# Altium project SAU-G0-EVM.PrjPcb
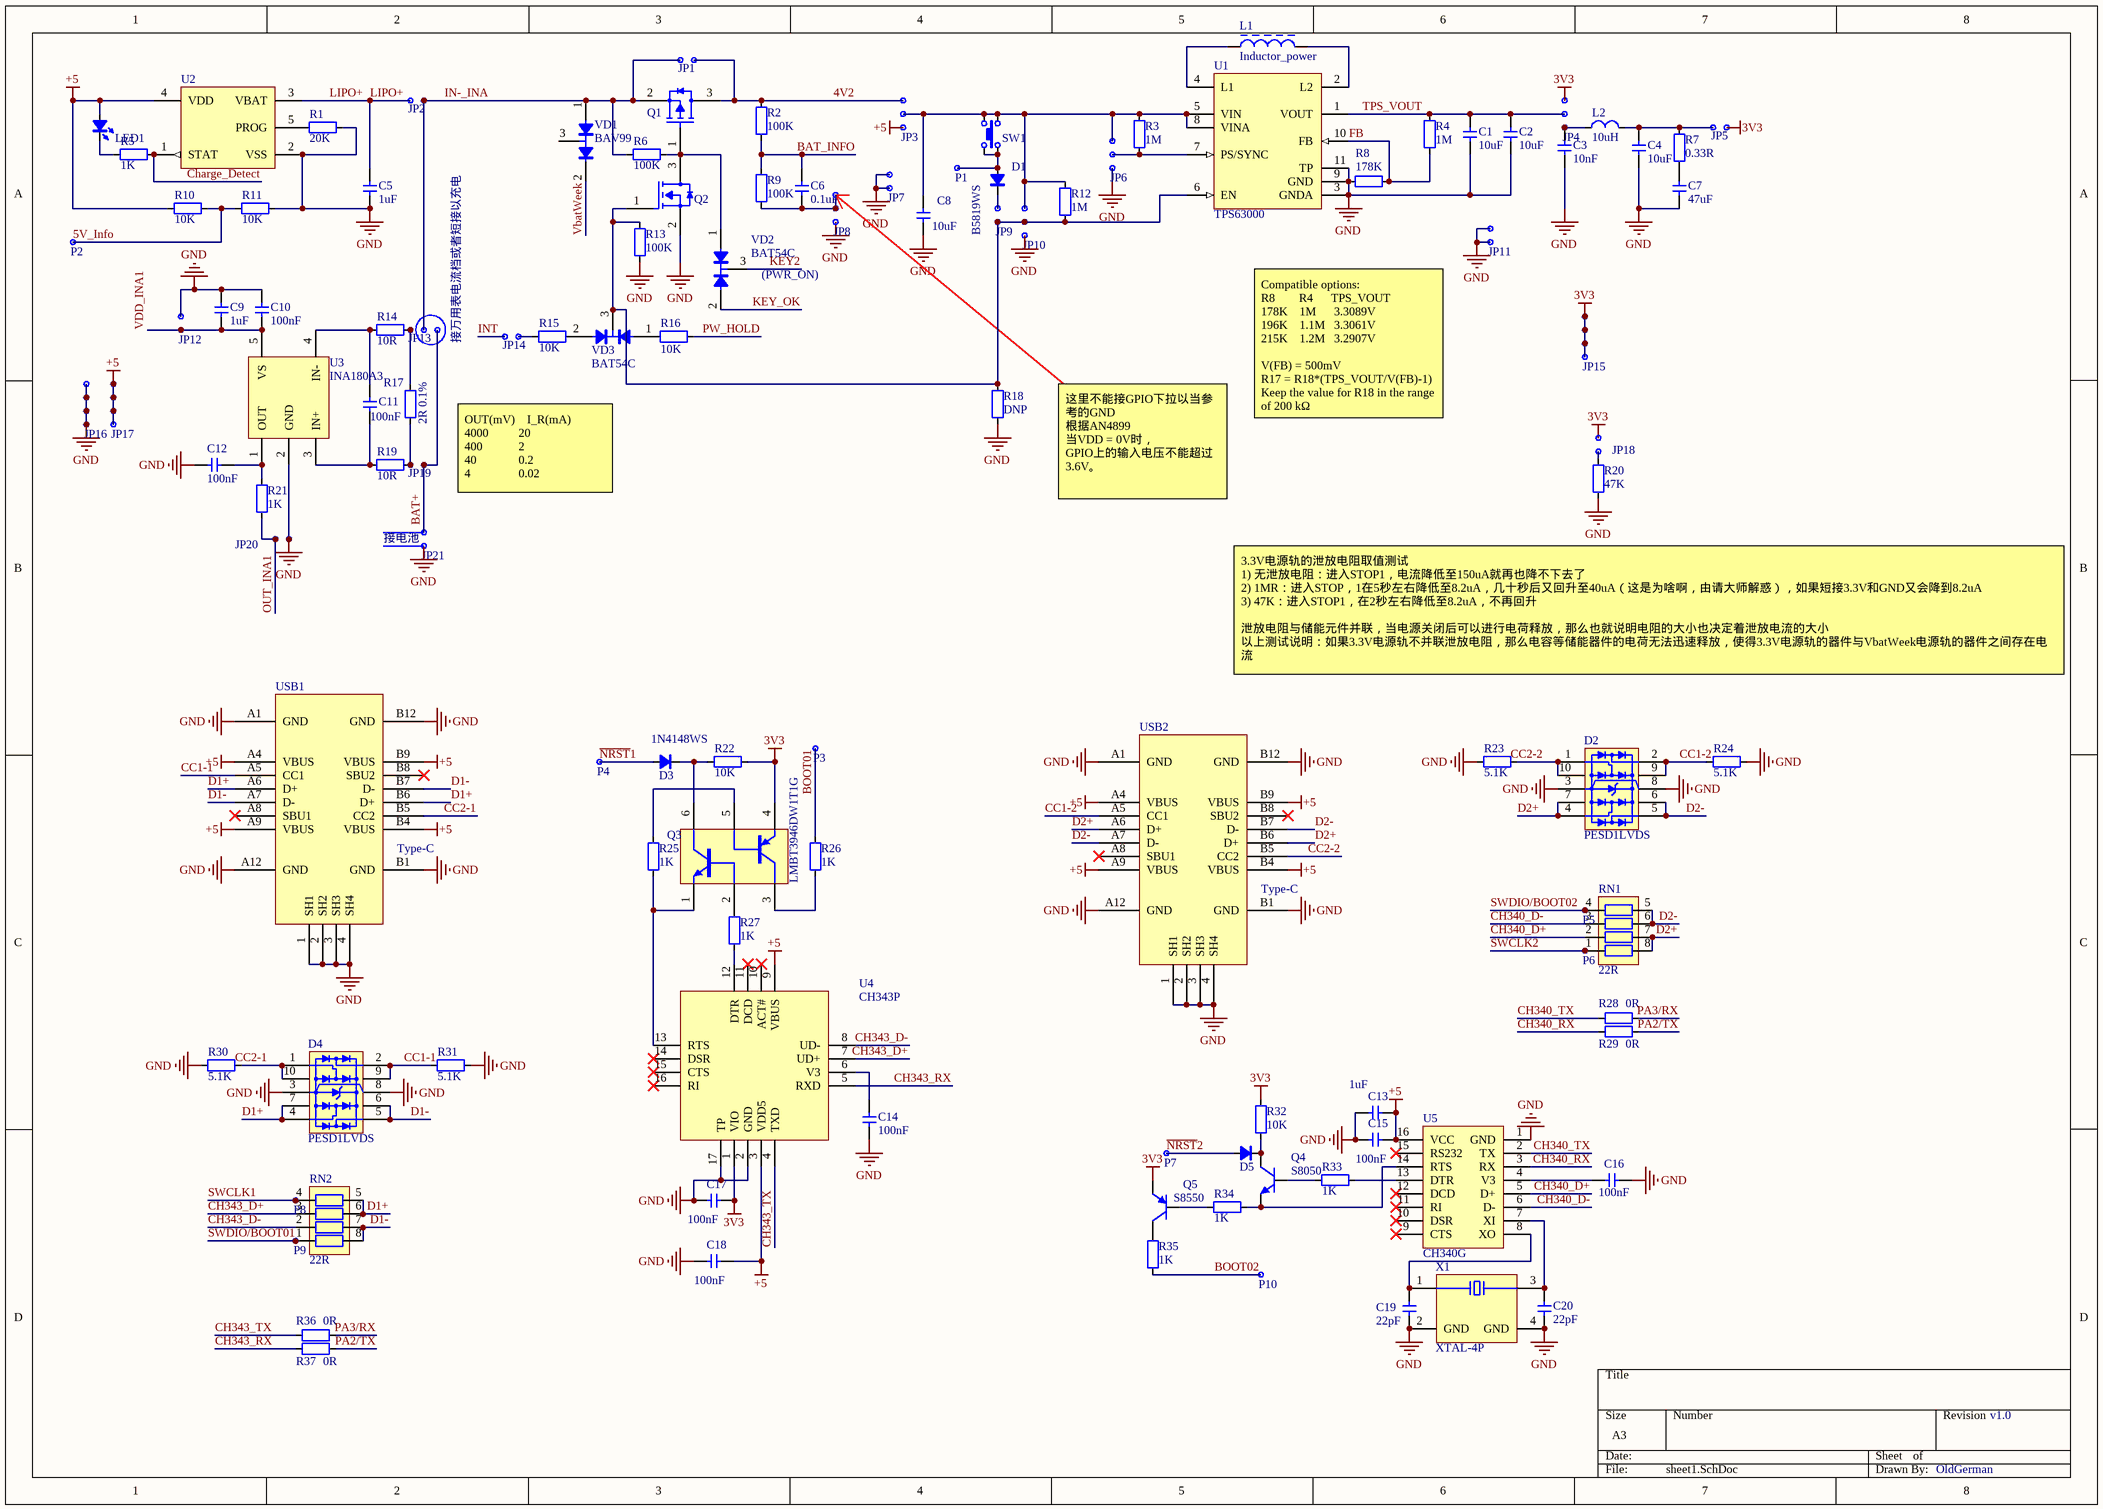
[diagram p0: sheet1.SchDoc]
4 sheets, 275 parts. Net scope: global (net labels, ports and power ports of the same name join across sheets).
Board file: pcb.PcbDoc
Sheets:
  sheet1.SchDoc
  sheet2.SchDoc
  sheet3.SchDoc
  sheet4.SchDoc

## Sheet sheet1.SchDoc
size A3

### Parts
C1  10uF  [C0603]
C2  10uF  [C0603]
C3  10nF  [C0603]
C4  10uF  [C0603]
C5  1uF  [C0603]
C6  0.1uF  [C0603]
C7  47uF  [C1206]
C8  10uF  [C0603]
C9  1uF  [C0603]
C10  100nF  [C0603]
C11  100nF  [C0603]
C12  100nF  [C0603]
C13  1uF  [C0603]
C14  100nF  [C0603]
C15  100nF  [C0603]
C16  100nF  [C0603]
C17  100nF  [C0603]
C18  100nF  [C0603]
C19  22pF  [C0603]
C20  22pF  [C0603]
D1  B5819WS  [SOD-323]
D2  PESD1LVDS  [DFN2510-10_SOT1165-1]
D3  1N4148WS  [SOD-323]
D4  PESD1LVDS  [DFN2510-10_SOT1165-1]
D5  DIODE  [SOD-323]  (value not drawn)
JP1  CONN_X2_DOT  [2.54mm_Male_x2]  (value not drawn)
JP2  CONN_X2_DOT  [2.54mm_Male_x2]  (value not drawn)
JP3  CONN_X3_DOT  [2.54mm_Male_x3]  (value not drawn)
JP4  CONN_X3_DOT  [2.54mm_Male_x3]  (value not drawn)
JP5  CONN_X2_DOT  [2.54mm_Male_x2]  (value not drawn)
JP6  CONN_X3_DOT  [2.54mm_Male_x3]  (value not drawn)
JP7  CONN_X2_DOT  [2.54mm_Male_x2]  (value not drawn)
JP8  CONN_X3_DOT  [2.54mm_Male_x3]  (value not drawn)
JP9  CONN_X2_DOT  [2.54mm_Male_x2]  (value not drawn)
JP10  CONN_X3_DOT  [2.54mm_Male_x3]  (value not drawn)
JP11  CONN_X2_DOT  [2.54mm_Male_x2]  (value not drawn)
JP12  CONN_X2_DOT  [2.54mm_Male_x2]  (value not drawn)
JP13  CONN_X3_DOT  [2.54mm_Male_x3]  (value not drawn)
JP14  CONN_X2_DOT  [2.54mm_Male_x2]  (value not drawn)
JP15  CONN_X4_DOT  [2.54mm_Male_x4]  (value not drawn)
JP16  CONN_X4_DOT  [2.54mm_Male_x4]  (value not drawn)
JP17  CONN_X4_DOT  [2.54mm_Male_x4]  (value not drawn)
JP18  CONN_X2_DOT  [2.54mm_Male_x2]  (value not drawn)
JP19  CONN_X2_DOT  [2.54mm_Male_x2]  (value not drawn)
JP20  CONN_X2_DOT  [2.54mm_Male_x2]  (value not drawn)
JP21  CONN_X2_DOT  [2.54mm_Male_x2]  (value not drawn)
L1  Inductor_power  [TDK VLS252012CX]
L2  10uH  [FER0805]
LED1  LED  [LED0603_WHITE]  (value not drawn)
P1  CONN_X1_DOT  [2.54mm_Male_x1]  (value not drawn)
P2  CONN_X1_DOT  [2.54mm_Male_x1]  (value not drawn)
P3  CONN_X1_DOT  [2.54mm_Male_x1]  (value not drawn)
P4  CONN_X1_DOT  [2.54mm_Male_x1]  (value not drawn)
P5  CONN_X1_DOT  [2.54mm_Male_x1]  (value not drawn)
P6  CONN_X1_DOT  [2.54mm_Male_x1]  (value not drawn)
P7  CONN_X1_DOT  [2.54mm_Male_x1]  (value not drawn)
P8  CONN_X1_DOT  [2.54mm_Male_x1]  (value not drawn)
P9  CONN_X1_DOT  [2.54mm_Male_x1]  (value not drawn)
P10  CONN_X1_DOT  [2.54mm_Male_x1]  (value not drawn)
Q1  P-MOS  [INFINEON SOT-23-3]  (value not drawn)
Q2  N-MOS  [INFINEON SOT-23-3]  (value not drawn)
Q3  LMBT3946DW1T1G  [ON SEMI SOT-363]
Q4  S8050  [INFINEON SOT-23-3]
Q5  S8550  [INFINEON SOT-23-3]
R1  20K  [R0603]
R2  100K  [R0603]
R3  1M  [R0603]
R4  1M  [R0603]
R5  1K  [R0603]
R6  100K  [R0603]
R7  0.33R  [R0603]
R8  178K  [R0603]
R9  100K  [R0603]
R10  10K  [R0603]
R11  10K  [R0603]
R12  1M  [R0603]
R13  100K  [R0603]
R14  10R  [R0603]
R15  10K  [R0603]
R16  10K  [R0603]
R17  2R 0.1%  [R0805]
R18  DNP  [R0603]
R19  10R  [R0603]
R20  47K  [R0603]
R21  1K  [R0603]
R22  10K  [R0603]
R23  5.1K  [R0603]
R24  5.1K  [R0603]
R25  1K  [R0603]
R26  1K  [R0603]
R27  1K  [R0603]
R28  0R  [R0603]
R29  0R  [R0603]
R30  5.1K  [R0603]
R31  5.1K  [R0603]
R32  10K  [R0603]
R33  1K  [R0603]
R34  1K  [R0603]
R35  1K  [R0603]
R36  0R  [R0603]
R37  0R  [R0603]
RN1  22R  [RESNET 1206-8 CONCAVE]
RN2  22R  [RESNET 1206-8 CONCAVE]
SW1  Button-4P  [SWITCH_3X4X2.5_4PIN_SMD]  (value not drawn)
U1  TPS63000  [TI PVSON-10 3x3MM DRC]
U2  MCP73831T  [MICROCHIP SOT-23-5 OT]  (value not drawn)
U3  INA180A3  [TI SOT-23-5 DBV]
U4  CH343P  [Analog QFN-16 3x3MM]
U5  CH340G  [TI SOP-16 D]
USB1  Type-C  [Type-C-TOP]
USB2  Type-C  [Type-C-TOP]
VD1  BAV99  [INFINEON SOT-23-3]
VD2  BAT54C  [INFINEON SOT-23-3]
VD3  BAT54C  [INFINEON SOT-23-3]
X1  XTAL-4P  [EPSON TSX-3225]

### Nets
3V3: C17.2 JP4.1 JP5.2 JP15.1 JP15.2 JP15.3 JP15.4 JP18.1 Q3.4(E) Q5.2(E) R22.1 R32.1 U4.1(VIO)
+5: C13.2 C15.2 C18.2 JP3.3 JP17.1 JP17.2 JP17.3 JP17.4 LED1.1(A) R10.2 U2.4(VDD) U4.3(VDD5) U4.9(VBUS) U5.16(VCC) USB1.A4(VBUS) USB1.A9(VBUS) USB1.B4(VBUS) USB1.B9(VBUS) USB2.A4(VBUS) USB2.A9(VBUS) USB2.B4(VBUS) USB2.B9(VBUS)
GND: C1.2 C2.2 C3.1 C4.2 C5.2 C7.2 C8.2 C9.2 C10.2 C12.2 C13.1 C14.2 C15.1 C16.2 C17.1 C18.1 C19.1 C20.1 D2.3(GND) D2.8(GND) D4.3(GND) D4.8(GND) JP6.3 JP7.1 JP7.2 JP8.3 JP10.3 JP11.1 JP11.2 JP12.1 JP16.1 JP16.2 JP16.3 JP16.4 JP20.2 JP21.2 Q2.2(S) R1.1 R8.2 R11.1 R13.1 R18.1 R20.1 R23.2 R24.1 R30.2 R31.1 U1.3(GNDA) U1.9(GND) U1.11(TP) U2.2(VSS) U3.2(GND) U4.2(GND) U4.17(TP) U5.1(GND) USB1.1(SH1) USB1.2(SH2) USB1.3(SH3) USB1.4(SH4) USB1.A1(GND) USB1.A12(GND) USB1.B1(GND) USB1.B12(GND) USB2.1(SH1) USB2.2(SH2) USB2.3(SH3) USB2.4(SH4) USB2.A1(GND) USB2.A12(GND) USB2.B1(GND) USB2.B12(GND) X1.2(GND) X1.4(GND)
4V2: JP1.2 JP3.1 Q1.3(D) R2.2
5V_Info: P2.1 R10.1 R11.2
BAT+: JP13.3 JP19.2 JP21.1
BAT_INFO: C6.1 R2.1 R9.2
BOOT01: P3.1 R26.1
BOOT02: P10.1 R35.2
CC1-1: D4.2(I/O) D4.9(GND) R31.2 USB1.A5(CC1)
CC1-2: D2.2(I/O) D2.9(GND) R24.2 USB2.A5(CC1)
CC2-1: D4.1(I/O) D4.10(GND) R30.1 USB1.B5(CC2)
CC2-2: D2.1(I/O) D2.10(GND) R23.1 USB2.B5(CC2)
CH340_D+: RN1.2 U5.5(D+)
CH340_D-: RN1.3 U5.6(D-)
CH340_RX: R29.1 U5.3(RX)
CH340_TX: R28.1 U5.2(TX)
CH343_D+: RN2.3 U4.7(UD+)
CH343_D-: RN2.2 U4.8(UD-)
CH343_RX: R37.1 U4.5(RXD)
CH343_TX: R36.1 U4.4(TXD)
Charge_Detect: R5.1 U2.1(STAT)
D1+: D4.4(I/O) D4.7(GND) RN2.5 RN2.6 USB1.A6(D+) USB1.B6(D+)
D1-: D4.5(I/O) D4.6(GND) RN2.7 RN2.8 USB1.A7(D-) USB1.B7(D-)
D2+: D2.4(I/O) D2.7(GND) RN1.7 RN1.8 USB2.A6(D+) USB2.B6(D+)
D2-: D2.5(I/O) D2.6(GND) RN1.5 RN1.6 USB2.A7(D-) USB2.B7(D-)
FB: R4.1 R8.1 U1.10(FB)
IN-_INA: JP1.1 JP2.2 JP13.2 Q1.2(S) R6.2 VD1.1
INT: JP14.1
KEY2: VD2.3
KEY_OK: VD2.2
LIPO+: C5.1 JP2.1 U2.3(VBAT)
~{NRST}1: D3.1(A) P4.1
~{NRST}2: D5.1(A) P7.1
OUT_INA1: JP20.1 R21.1
PA2/TX: R29.2 R37.2
PA3/RX: R28.2 R36.2
PW_HOLD: R16.1
SWCLK1: P8.1 RN2.4
SWCLK2: P6.1 RN1.1
SWDIO/BOOT01: P9.1 RN2.1
SWDIO/BOOT02: P5.1 RN1.4
TPS_VOUT: C1.1 C2.1 JP4.2 R4.2 U1.1(VOUT)
VbatWeek: VD1.2
VDD_INA1: C9.1 C10.1 JP12.2 U3.5(VS)
NetC3_2: C3.2 JP4.3 L2.1
NetC4_1: C4.1 JP5.1 L2.2 R7.2
NetC6_2: C6.2 JP8.1 JP8.2 R9.1
NetC7_1: C7.1 R7.1
NetC8_1: C8.1 JP3.2 JP6.1 JP10.1 R3.1 R12.1 SW1.3 SW1.4 U1.5(VIN) U1.8(VINA)
NetC11_1: C11.1 R19.1 U3.3(IN+)
NetC11_2: C11.2 R14.1 U3.4(IN-)
NetC12_1: C12.1 R21.2 U3.1(OUT)
NetC14_1: C14.1 U4.6(V3)
NetC16_1: C16.1 U5.4(V3)
NetC19_2: C19.2 U5.8(XO) X1.1
NetC20_2: C20.2 U5.7(XI) X1.3
NetD1_1: D1.1(A) P1.1 SW1.1 SW1.2
NetD1_2: D1.2(C) JP9.1
NetD3_2: D3.2(C) Q3.6(C) R22.2
NetD5_2: D5.2(C) Q4.3(C) R32.2
NetJP6_2: JP6.2 R3.2 U1.7(PS/SYNC)
NetJP9_2: JP9.2 JP10.2 Q2.1(G) R12.2 R13.2 R18.2 U1.6(EN) VD3.3
NetJP13_1: JP13.1 R14.2 R17.1
NetJP14_2: JP14.2 R15.1
NetJP18_2: JP18.2 R20.2
NetJP19_1: JP19.1 R17.2 R19.2
NetL1_1: L1.1 U1.4(L1)
NetL1_2: L1.2 U1.2(L2)
NetLED1_2: LED1.2(K) R5.2
NetQ1_1: Q1.1(G) Q2.3(D) R6.1 VD2.1
NetQ3_1: Q3.1(E) R25.2 U4.13(RTS)
NetQ3_2: Q3.2(B) R27.2
NetQ3_3: Q3.3(C) R26.2
NetQ3_5: Q3.5(B) R25.1
NetQ4_1: Q4.1(B) R33.1
NetQ4_2: Q4.2(E) R34.2 U5.14(RTS)
NetQ5_1: Q5.1(B) R34.1
NetQ5_3: Q5.3(C) R35.1
NetR1_2: R1.2 U2.5(PROG)
NetR15_2: R15.2 VD3.2
NetR16_2: R16.2 VD3.1
NetR27_1: R27.1 U4.12(DTR)
NetR33_2: R33.2 U5.13(DTR)

Not connected (* = marked no-connect by the designer): U4 10(ACT#)* 11(DCD)* 14(DSR)* 15(CTS)* 16(RI)*; U5 9(CTS)* 10(DSR)* 11(RI)* 12(DCD)* 15(RS232)*; USB1 A8(SBU1)* B8(SBU2)*; USB2 A8(SBU1)* B8(SBU2)*; VD1 3

### Notes on the sheet
- (PWR_ON)
- (near JP13) 接万用表电流档或者短接以充电
- Compatible options:
  R8        R4      TPS_VOUT
  178K    1M      3.3089V
  196K    1.1M   3.3061V
  215K    1.2M   3.2907V
  V(FB) = 500mV
  R17 = R18*(TPS_VOUT/V(FB)-1)
  Keep the value for R18 in the range of 200 kΩ
- OUT(mV)    I_R(mA)
  4000          20
  400            2
  40              0.2
  4                0.02
- 这里不能接GPIO下拉以当参考的GND
  根据AN4899
  当VDD = 0V时，
  GPIO上的输入电压不能超过3.6V。
- (near JP21) 接电池
- 3.3V电源轨的泄放电阻取值测试
  1) 无泄放电阻：进入STOP1，电流降低至150uA就再也降不下去了
  2) 1MR：进入STOP，1在5秒左右降低至8.2uA，几十秒后又回升至40uA（这是为啥啊，由请大师解惑），如果短接3.3V和GND又会降到8.2uA
  3) 47K：进入STOP1，在2秒左右降低至8.2uA，不再回升
  泄放电阻与储能元件并联，当电源关闭后可以进行电荷释放，那么也就说明电阻的大小也决定着泄放电流的大小
  以上测试说明：如果3.3V电源轨不并联泄放电阻，那么电容等储能器件的电荷无法迅速释放，使得3.3V电源轨的器件与VbatWeek电源轨的器件之间存在电流
- v1.0
- OldGerman

### Library data of the parts
C1-C20 = CAP: Capacitor; Value: 0.1u
D1 = DIODE: 肖特基二极管
D2 D4 = PESD1LVDS: Ultra-Low Capacitance TVS Protection; BOM名称: 钳位IC; 版权归属: 源创客; 属性: 30V/0.2A; 学习资源: www.ooocke.com
D3 D5 = DIODE: 二极管
L1 = Inductor_power: 功率电感
L2 = inductor_mini: 贴片叠层电感
LED1 = LED: Value: color?
Q1 = P-MOS_123
Q2 = N-MOS_123
Q3 = LMBT3946DW1T1G: PNP+NPN, SOT-363; ComponentLink1Description: Datasheet; ComponentLink1URL: https://fscdn.rohm.com/en/products/databook/datasheet/discrete/transistor/digital/umh3ntn-e.pdf
Q4 = S8050: NPN型; BOM名称: 高频放大-NPN型; 版权归属: 源创客; 属性: 40V 1.5A 1W 100MHZ; 学习资源: www.ooocke.com
Q5 = S8550: PNP型; BOM名称: 高频放大-NPN型; 版权归属: 源创客; 属性: 40V 1.5A 1W 100MHZ; 学习资源: www.ooocke.com
R1-R37 = RES: Resistor; Value: 22R
RN1 RN2 = RES-8P4R: 贴片网络排阻; 版权归属: 源创客; BOM名称: 贴片网络排阻; 学习资源: www.ooocke.com
SW1 = Button-4P: Button
U1 = TPS63000: Buck-Boost Converter / 具有 1.8A 电流开关并采用 3x3 QFN 封装的高效率降压/升压转换器; ComponentLink1Description: TPS63000; ComponentLink1URL: https://www.ti.com.cn/cn/lit/gpn/tps63000
U3 = INA180Ax: Low- and High-Side Voltage Output, Current-Sense Amplifiers
U4 = CH343P: usb to ttl
U5 = CH340G: 丐中丐，需要外接12M晶振
USB1 USB2 = USB-Type-C_16P
VD1 = BAV99: Dual Series Switching Diodes; BOM名称: 肖特基二极管; 版权归属: 源创客; 属性: 30V/0.2A; 学习资源: www.ooocke.com; ComponentLink1Description: Datasheet; ComponentLink1URL: https://www.onsemi.com/pub/Collateral/BAV99WT1-D.PDF
VD2 VD3 = BAT54C: 贴片肖特基二极管; BOM名称: 肖特基二极管; 版权归属: 源创客; 属性: 30V/0.2A; 学习资源: www.ooocke.com
X1 = XTAL-4P: 4脚无源石英晶振; BOM名称: 4脚无源晶振; 版权归属: 源创客; 学习资源: www.ooocke.com

## Sheet sheet2.SchDoc
size A4
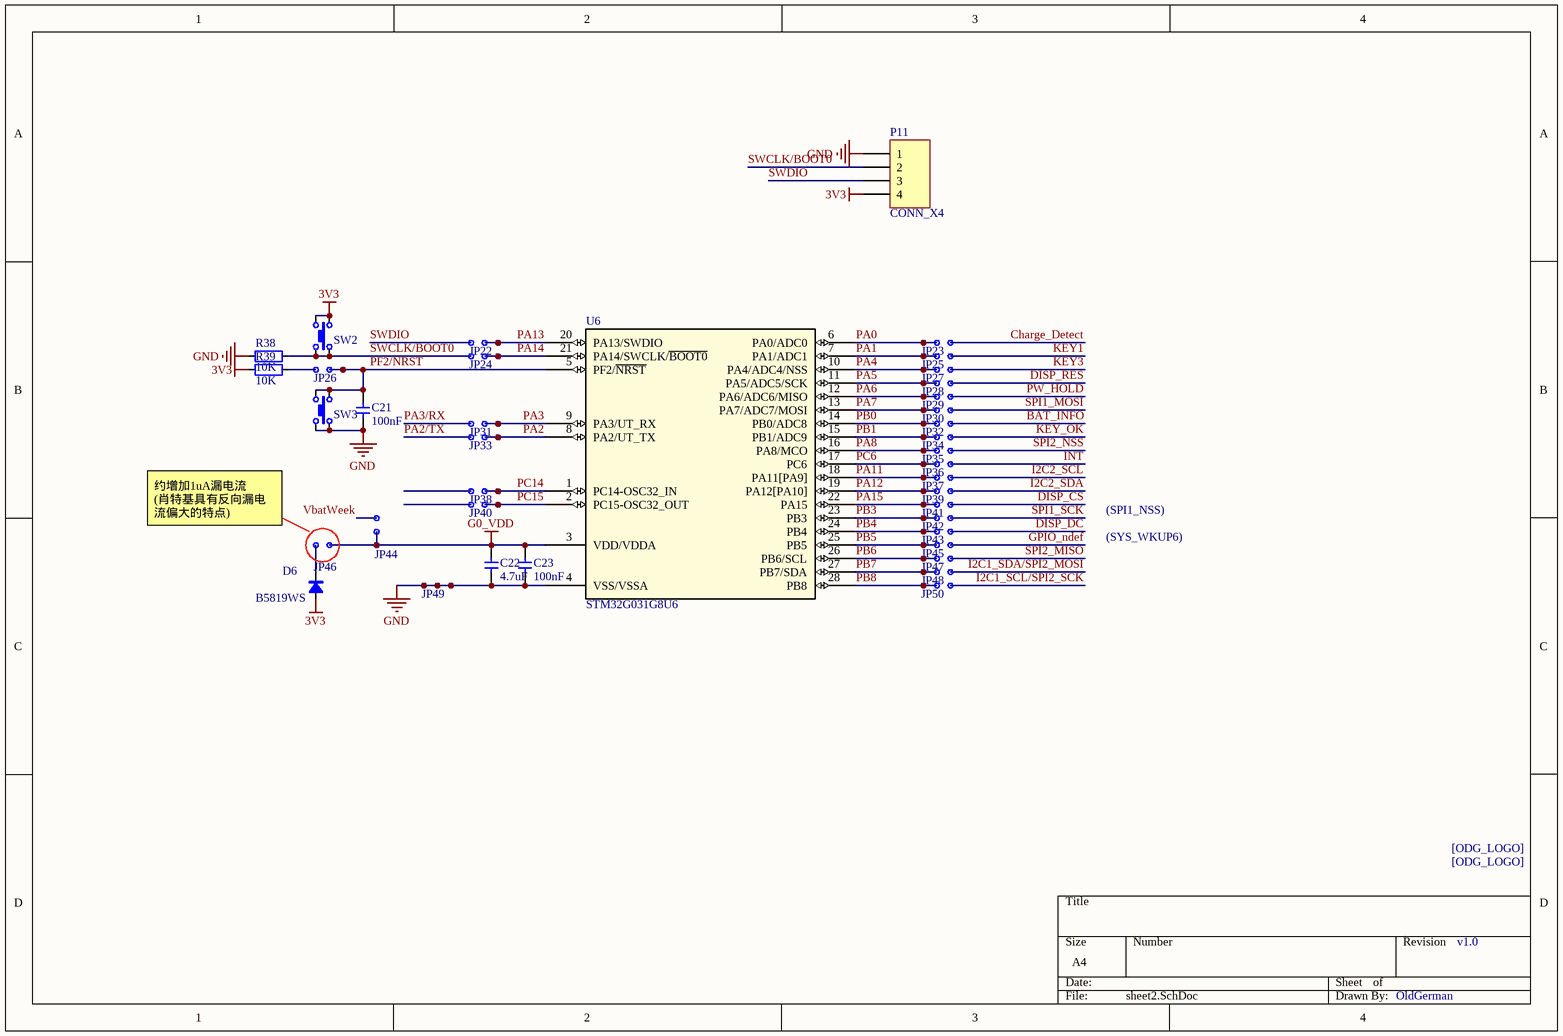
[diagram p1: sheet2.SchDoc]

### Parts
C21  100nF  [C0603]
C22  4.7uF  [C0603]
C23  100nF  [C0603]
D6  B5819WS  [SOD-323]
JP22  CONN_X3_DOT  [2.54mm_Male_x3]  (value not drawn)
JP23  CONN_X3_DOT  [2.54mm_Male_x3]  (value not drawn)
JP24  CONN_X3_DOT  [2.54mm_Male_x3]  (value not drawn)
JP25  CONN_X3_DOT  [2.54mm_Male_x3]  (value not drawn)
JP26  CONN_X3_DOT  [2.54mm_Male_x3]  (value not drawn)
JP27  CONN_X3_DOT  [2.54mm_Male_x3]  (value not drawn)
JP28  CONN_X3_DOT  [2.54mm_Male_x3]  (value not drawn)
JP29  CONN_X3_DOT  [2.54mm_Male_x3]  (value not drawn)
JP30  CONN_X3_DOT  [2.54mm_Male_x3]  (value not drawn)
JP31  CONN_X3_DOT  [2.54mm_Male_x3]  (value not drawn)
JP32  CONN_X3_DOT  [2.54mm_Male_x3]  (value not drawn)
JP33  CONN_X3_DOT  [2.54mm_Male_x3]  (value not drawn)
JP34  CONN_X3_DOT  [2.54mm_Male_x3]  (value not drawn)
JP35  CONN_X3_DOT  [2.54mm_Male_x3]  (value not drawn)
JP36  CONN_X3_DOT  [2.54mm_Male_x3]  (value not drawn)
JP37  CONN_X3_DOT  [2.54mm_Male_x3]  (value not drawn)
JP38  CONN_X3_DOT  [2.54mm_Male_x3]  (value not drawn)
JP39  CONN_X3_DOT  [2.54mm_Male_x3]  (value not drawn)
JP40  CONN_X3_DOT  [2.54mm_Male_x3]  (value not drawn)
JP41  CONN_X3_DOT  [2.54mm_Male_x3]  (value not drawn)
JP42  CONN_X3_DOT  [2.54mm_Male_x3]  (value not drawn)
JP43  CONN_X3_DOT  [2.54mm_Male_x3]  (value not drawn)
JP44  CONN_X3_DOT  [2.54mm_Male_x3]  (value not drawn)
JP45  CONN_X3_DOT  [2.54mm_Male_x3]  (value not drawn)
JP46  CONN_X2_DOT  [2.54mm_Male_x2]  (value not drawn)
JP47  CONN_X3_DOT  [2.54mm_Male_x3]  (value not drawn)
JP48  CONN_X3_DOT  [2.54mm_Male_x3]  (value not drawn)
JP49  CONN_X3_DOT  [2.54mm_Male_x3]  (value not drawn)
JP50  CONN_X3_DOT  [2.54mm_Male_x3]  (value not drawn)
ODG1  ODG_LOGO  [ODG_LOGO_soldermask]  (value not drawn)
ODG2  ODG_LOGO  [ODG_LOGO_soldermask]  (value not drawn)
P11  CONN_X4  [2.54mm_Male_x4]
R38  10K  [R0603]
R39  10K  [R0603]
SW2  Button-4P  [SWITCH_3X4X2.5_4PIN_SMD]  (value not drawn)
SW3  Button-4P  [SWITCH_3X4X2.5_4PIN_SMD]  (value not drawn)
U6  STM32G031G8U6  [UFQFPN28-4x4mm_ODG]

### Nets
3V3: D6.1(A) P11.4 R39.2 SW2.3 SW2.4
G0_VDD: C22.1 C23.1 JP44.2 JP44.3 JP46.1 U6.3(VDD/VDDA)
GND: C21.2 C22.2 C23.2 JP49.1 JP49.2 JP49.3 P11.1 R38.2 SW3.1 SW3.2 U6.4(VSS/VSSA)
BAT_INFO: JP32.3
Charge_Detect: JP23.3
DISP_CS: JP41.3
DISP_DC: JP43.3
DISP_RES: JP28.3
GPIO_ndef: JP45.3
I2C1_SCL/SPI2_SCK: JP50.3
I2C1_SDA/SPI2_MOSI: JP48.3
I2C2_SCL: JP37.3
I2C2_SDA: JP39.3
INT: JP36.3
KEY1: JP25.3
KEY3: JP27.3
KEY_OK: JP34.3
PA0: JP23.1 JP23.2 U6.6(PA0/ADC0)
PA1: JP25.1 JP25.2 U6.7(PA1/ADC1)
PA2: JP33.2 JP33.3 U6.8(PA2/UT_TX)
PA2/TX: JP33.1
PA3: JP31.2 JP31.3 U6.9(PA3/UT_RX)
PA3/RX: JP31.1
PA4: JP27.1 JP27.2 U6.10(PA4/ADC4/NSS)
PA5: JP28.1 JP28.2 U6.11(PA5/ADC5/SCK)
PA6: JP29.1 JP29.2 U6.12(PA6/ADC6/MISO)
PA7: JP30.1 JP30.2 U6.13(PA7/ADC7/MOSI)
PA8: JP35.1 JP35.2 U6.16(PA8/MCO)
PA11: JP37.1 JP37.2 U6.18(PA11[PA9])
PA12: JP39.1 JP39.2 U6.19(PA12[PA10])
PA13: JP22.2 JP22.3 U6.20(PA13/SWDIO)
PA14: JP24.2 JP24.3 U6.21(PA14/SWCLK/~{BOOT0})
PA15: JP41.1 JP41.2 U6.22(PA15)
PB0: JP32.1 JP32.2 U6.14(PB0/ADC8)
PB1: JP34.1 JP34.2 U6.15(PB1/ADC9)
PB3: JP42.1 JP42.2 U6.23(PB3)
PB4: JP43.1 JP43.2 U6.24(PB4)
PB5: JP45.1 JP45.2 U6.25(PB5)
PB6: JP47.1 JP47.2 U6.26(PB6/SCL)
PB7: JP48.1 JP48.2 U6.27(PB7/SDA)
PB8: JP50.1 JP50.2 U6.28(PB8)
PC6: JP36.1 JP36.2 U6.17(PC6)
PC14: JP38.2 JP38.3 U6.1(PC14-OSC32_IN)
PC15: JP40.2 JP40.3 U6.2(PC15-OSC32_OUT)
PF2/~{NRST}: C21.1 JP26.2 JP26.3 SW3.3 SW3.4 U6.5(PF2/~{NRST})
PW_HOLD: JP29.3
SPI1_MOSI: JP30.3
SPI1_SCK: JP42.3
SPI2_MISO: JP47.3
SPI2_NSS: JP35.3
SWCLK/BOOT0: JP24.1 P11.2 R38.1 SW2.1 SW2.2
SWDIO: JP22.1 P11.3
VbatWeek: JP44.1
NetD6_2: D6.2(C) JP46.2
NetJP26_1: JP26.1 R39.1

Not connected (* = marked no-connect by the designer): JP38 1; JP40 1

### Notes on the sheet
- 约增加1uA漏电流
  (肖特基具有反向漏电流偏大的特点)
- (SPI1_NSS)
- (SYS_WKUP6)
- v1.0
- OldGerman
- (in symbol ODG_LOGO) [ODG_LOGO]

### Library data of the parts
C21-C23 = CAP: Capacitor; Value: 0.1u
D6 = DIODE: 肖特基二极管
R38 R39 = RES: Resistor; Value: 22R
SW2 SW3 = Button-4P: Button
U6 = STM32G031G8U6: No Description Available; Mfr_Name: STMicroelectronics; Copyright: Copyright (C) 2022 Ultra Librarian. All rights reserved.; Manufacturer_Part_Number: STM32G031G8U6; RefDes: RefDes; Type: DEV

## Sheet sheet3.SchDoc
size A4
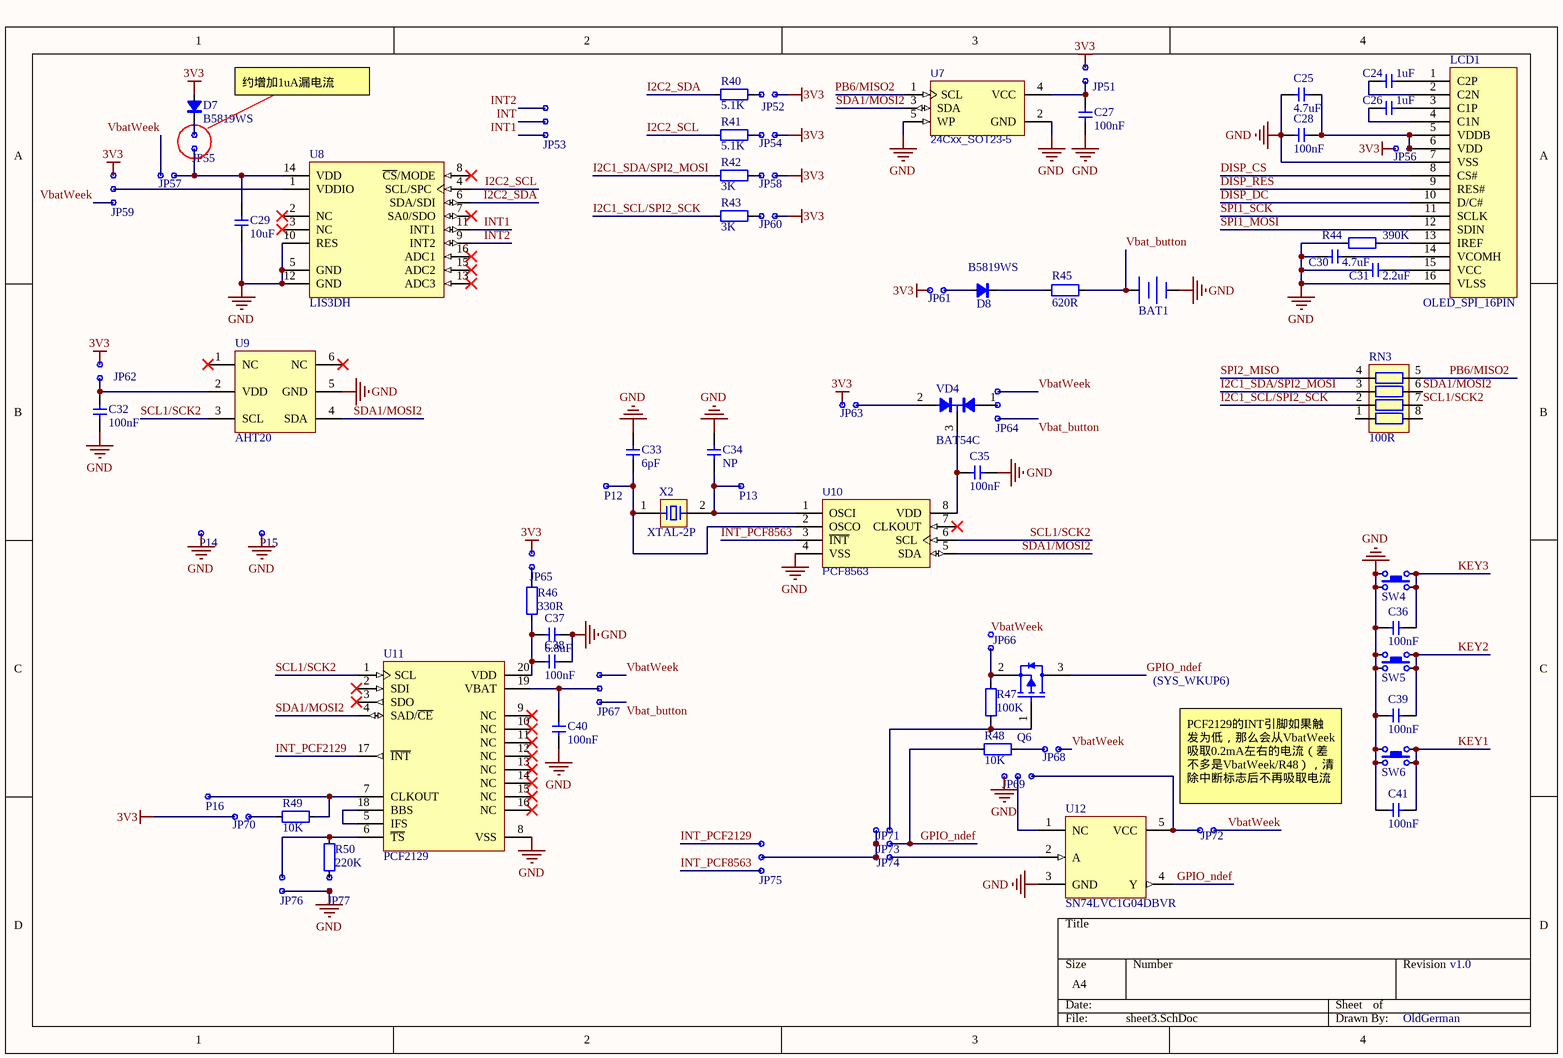
[diagram p2: sheet3.SchDoc]

### Parts
BAT1  BAT  [MS621FE-FL11E]  (value not drawn)
C24  1uF  [C0603]
C25  4.7uF  [C0603]
C26  1uF  [C0603]
C27  100nF  [C0603]
C28  100nF  [C0603]
C29  10uF  [C0603]
C30  4.7uF  [C0603]
C31  2.2uF  [C0603]
C32  100nF  [C0603]
C33  6pF  [C0603]
C34  NP  [C0603]
C35  100nF  [C0603]
C36  100nF  [C0603]
C37  6.8uF  [C0603]
C38  100nF  [C0603]
C39  100nF  [C0603]
C40  100nF  [C0603]
C41  100nF  [C0603]
D7  B5819WS  [SOD-323]
D8  B5819WS  [SOD-323]
JP51  CONN_X2_DOT  [2.54mm_Male_x2]  (value not drawn)
JP52  CONN_X2_DOT  [2.54mm_Male_x2]  (value not drawn)
JP53  CONN_X3_DOT  [2.54mm_Male_x3]  (value not drawn)
JP54  CONN_X2_DOT  [2.54mm_Male_x2]  (value not drawn)
JP55  CONN_X2_DOT  [2.54mm_Male_x2]  (value not drawn)
JP56  CONN_X2_DOT  [2.54mm_Male_x2]  (value not drawn)
JP57  CONN_X2_DOT  [2.54mm_Male_x2]  (value not drawn)
JP58  CONN_X2_DOT  [2.54mm_Male_x2]  (value not drawn)
JP59  CONN_X3_DOT  [2.54mm_Male_x3]  (value not drawn)
JP60  CONN_X2_DOT  [2.54mm_Male_x2]  (value not drawn)
JP61  CONN_X2_DOT  [2.54mm_Male_x2]  (value not drawn)
JP62  CONN_X2_DOT  [2.54mm_Male_x2]  (value not drawn)
JP63  CONN_X2_DOT  [2.54mm_Male_x2]  (value not drawn)
JP64  CONN_X3_DOT  [2.54mm_Male_x3]  (value not drawn)
JP65  CONN_X2_DOT  [2.54mm_Male_x2]  (value not drawn)
JP66  CONN_X2_DOT  [2.54mm_Male_x2]  (value not drawn)
JP67  CONN_X3_DOT  [2.54mm_Male_x3]  (value not drawn)
JP68  CONN_X2_DOT  [2.54mm_Male_x2]  (value not drawn)
JP69  CONN_X3_DOT  [2.54mm_Male_x3]  (value not drawn)
JP70  CONN_X2_DOT  [2.54mm_Male_x2]  (value not drawn)
JP71  CONN_X2_DOT  [2.54mm_Male_x2]  (value not drawn)
JP72  CONN_X2_DOT  [2.54mm_Male_x2]  (value not drawn)
JP73  CONN_X2_DOT  [2.54mm_Male_x2]  (value not drawn)
JP74  CONN_X2_DOT  [2.54mm_Male_x2]  (value not drawn)
JP75  CONN_X3_DOT  [2.54mm_Male_x3]  (value not drawn)
JP76  CONN_X2_DOT  [2.54mm_Male_x2]  (value not drawn)
JP77  CONN_X2_DOT  [2.54mm_Male_x2]  (value not drawn)
LCD1  OLED_SPI_16PIN  [oled_64x48_0.66_SSD1306_TOP_straight_no_3d]
P12  CONN_X1_DOT  [2.54mm_Male_x1]  (value not drawn)
P13  CONN_X1_DOT  [2.54mm_Male_x1]  (value not drawn)
P14  CONN_X1_DOT  [2.54mm_Male_x1]  (value not drawn)
P15  CONN_X1_DOT  [2.54mm_Male_x1]  (value not drawn)
P16  CONN_X1_DOT  [2.54mm_Male_x1]  (value not drawn)
Q6  P-MOS  [INFINEON SOT-23-3]  (value not drawn)
R40  5.1K  [R0603]
R41  5.1K  [R0603]
R42  3K  [R0603]
R43  3K  [R0603]
R44  390K  [R0603]
R45  620R  [R0603]
R46  330R  [R0603]
R47  100K  [R0603]
R48  10K  [R0603]
R49  10K  [R0603]
R50  220K  [R0603]
RN3  100R  [RESNET 1206-8 CONCAVE]
SW4  Button-4P  [SWITCH_3X4X2.5_4PIN_SMD]  (value not drawn)
SW5  Button-4P  [SWITCH_3X4X2.5_4PIN_SMD]  (value not drawn)
SW6  Button-4P  [SWITCH_3X4X2.5_4PIN_SMD]  (value not drawn)
U7  24Cxx_SOT23-5  [MICROCHIP SOT-23-5 OT]
U8  LIS3DH  [LGA-16-3X3]
U9  AHT20  [AHT20]
U10  PCF8563  [ANALOG DEV SOIC-8 R8]
U11  PCF2129  [NXP_SO20]
U12  SN74LVC1G04DBVR  [TI SOT-23-5 DBV]
VD4  BAT54C  [INFINEON SOT-23-3]
X2  XTAL-2P  [XTAL_2P_3215]

### Nets
3V3: D7.1(A) JP51.1 JP52.2 JP54.2 JP56.1 JP58.2 JP59.1 JP60.2 JP61.1 JP62.1 JP63.1 JP65.1 JP70.1
GND: BAT1.2(-) C25.2 C27.2 C28.1 C29.2 C30.2 C31.2 C32.2 C33.1 C34.1 C35.2 C36.1 C37.2 C38.2 C39.1 C40.2 C41.1 JP69.1 JP76.2 JP77.2 LCD1.7(VSS) LCD1.16(VLSS) P14.1 P15.1 R44.1 SW4.1 SW4.2 SW5.1 SW5.2 SW6.1 SW6.2 U7.2(GND) U7.5(WP) U8.5(GND) U8.10(RES) U8.12(GND) U9.5(GND) U10.4(VSS) U11.8(VSS) U12.3(GND)
DISP_CS: LCD1.8(CS#)
DISP_DC: LCD1.10(D/C#)
DISP_RES: LCD1.9(RES#)
GPIO_ndef: JP73.2 Q6.3(D) R48.2 U12.4(Y)
I2C1_SCL/SPI2_SCK: R43.2 RN3.2
I2C1_SDA/SPI2_MOSI: R42.2 RN3.3
I2C2_SCL: R41.2 U8.4(SCL/SPC)
I2C2_SDA: R40.2 U8.6(SDA/SDI)
INT: JP53.2
INT1: JP53.3 U8.11(INT1)
INT2: JP53.1 U8.9(INT2)
INT_PCF2129: JP75.1 U11.17(~{INT})
INT_PCF8563: JP75.3 U10.3(~{INT})
KEY1: C41.2 SW6.3 SW6.4
KEY2: C39.2 SW5.3 SW5.4
KEY3: C36.2 SW4.3 SW4.4
PB6/MISO2: RN3.5 U7.1(SCL)
SCL1/SCK2: RN3.7 U9.3(SCL) U10.6(SCL) U11.1(SCL)
SDA1/MOSI2: RN3.6 U7.3(SDA) U9.4(SDA) U10.5(SDA) U11.4(SAD/~{CE})
SPI1_MOSI: LCD1.12(SDIN)
SPI1_SCK: LCD1.11(SCLK)
SPI2_MISO: RN3.4
Vbat_button: BAT1.1(+) JP64.3 JP67.3 R45.2
VbatWeek: JP57.1 JP59.3 JP64.1 JP66.1 JP67.1 JP68.2 JP72.2
NetC24_1: C24.1 LCD1.1(C2P)
NetC24_2: C24.2 LCD1.2(C2N)
NetC25_1: C25.1 C28.2 JP56.2 LCD1.5(VDDB) LCD1.6(VDD)
NetC26_1: C26.1 LCD1.3(C1P)
NetC26_2: C26.2 LCD1.4(C1N)
NetC27_1: C27.1 JP51.2 U7.4(VCC)
NetC29_1: C29.1 JP55.2 JP57.2 U8.14(VDD)
NetC30_1: C30.1 LCD1.14(VCOMH)
NetC31_1: C31.1 LCD1.15(VCC)
NetC32_1: C32.1 JP62.2 U9.2(VDD)
NetC33_2: C33.2 P12.1 U10.2(OSCO) X2.1
NetC34_2: C34.2 P13.1 U10.1(OSCI) X2.2
NetC35_1: C35.1 U10.8(VDD) VD4.3
NetC37_1: C37.1 C38.1 R46.1 U11.20(VDD)
NetC40_1: C40.1 JP67.2 U11.19(VBAT)
NetD7_2: D7.2(C) JP55.1
NetD8_1: D8.1(A) JP61.2
NetD8_2: D8.2(C) R45.1
NetJP52_1: JP52.1 R40.1
NetJP54_1: JP54.1 R41.1
NetJP58_1: JP58.1 R42.1
NetJP59_2: JP59.2 U8.1(VDDIO)
NetJP60_1: JP60.1 R43.1
NetJP63_2: JP63.2 VD4.2
NetJP64_2: JP64.2 VD4.1
NetJP65_2: JP65.2 R46.2
NetJP66_2: JP66.2 Q6.2(S) R47.2
NetJP68_1: JP68.1 R48.1
NetJP69_2: JP69.2 U12.1(NC)
NetJP69_3: JP69.3 JP72.1 U12.5(VCC)
NetJP70_2: JP70.2 R49.2
NetJP71_1: JP71.1 JP73.1 JP74.1 JP75.2
NetJP71_2: JP71.2 Q6.1(G) R47.1
NetJP74_2: JP74.2 U12.2(A)
NetJP76_1: JP76.1 R50.2 U11.6(~{TS})
NetJP77_1: JP77.1 R50.1
NetLCD1_13: LCD1.13(IREF) R44.2
NetP16_1: P16.1 R49.1 U11.7(CLKOUT)
NetU11_5: U11.5(IFS) U11.18(BBS)

Not connected (* = marked no-connect by the designer): RN3 1 8; U8 2(NC)* 3(NC)* 7(SA0/SDO)* 8(~{CS}/MODE)* 13(ADC3)* 15(ADC2)* 16(ADC1)*; U9 1(NC)* 6(NC)*; U10 7(CLKOUT)*; U11 2(SDI)* 3(SDO)* 9(NC)* 10(NC)* 11(NC)* 12(NC)* 13(NC)* 14(NC)* 15(NC)* 16(NC)*

### Notes on the sheet
- 约增加1uA漏电流
  (肖特基具有反向漏电流偏大的特点)
- (near Q6) (SYS_WKUP6)
- PCF2129的INT引脚如果触发为低，那么会从VbatWeek吸取0.2mA左右的电流（差不多是VbatWeek/R48），清除中断标志后不再吸取电流
- v1.0
- OldGerman

### Library data of the parts
BAT1 = BAT: 锂电池; Auther: JonesLee; Value: BAT; Publish: 11-4-2017
C24-C41 = CAP: Capacitor; Value: 0.1u
D7 D8 = DIODE: 二极管
Q6 = P-MOS_123
R40-R50 = RES: Resistor; Value: 22R
RN3 = RES-8P4R: 贴片网络排阻; 版权归属: 源创客; BOM名称: 贴片网络排阻; 学习资源: www.ooocke.com
SW4-SW6 = Button-4P: Button
U8 = LIS3DH: The LIS3DH is an ultra-low-power highperformance three-axis linear accelerometer belonging to the “nano” family, with digital I2C/SPI serial interface standard output. The device features ultra-low-power operational modes that allow advanced power saving and smart embedded functions.; ComponentLink1Description: Datasheet; ComponentLink1URL: https://www.bosch-sensortec.com/media/boschsensortec/downloads/datasheets/bst-bmi160-ds000.pdf
U9 = AHT20: 线性稳压芯片; BOM名称: 可调升压芯片; 版权归属: 源创客; 学习资源: www.ooocke.com
U11 = PCF2129: RTC
U12 = SN74LVC1G04DBVR: IC GATE NOT
VD4 = BAT54C: as VD2 on sheet sheet1; 学习资源: www.ooocke.com
X2 = XTAL-2P: 2脚无源石英晶振; BOM名称: 4脚无源晶振; 版权归属: 源创客; 学习资源: www.ooocke.com

## Sheet sheet4.SchDoc
size A4
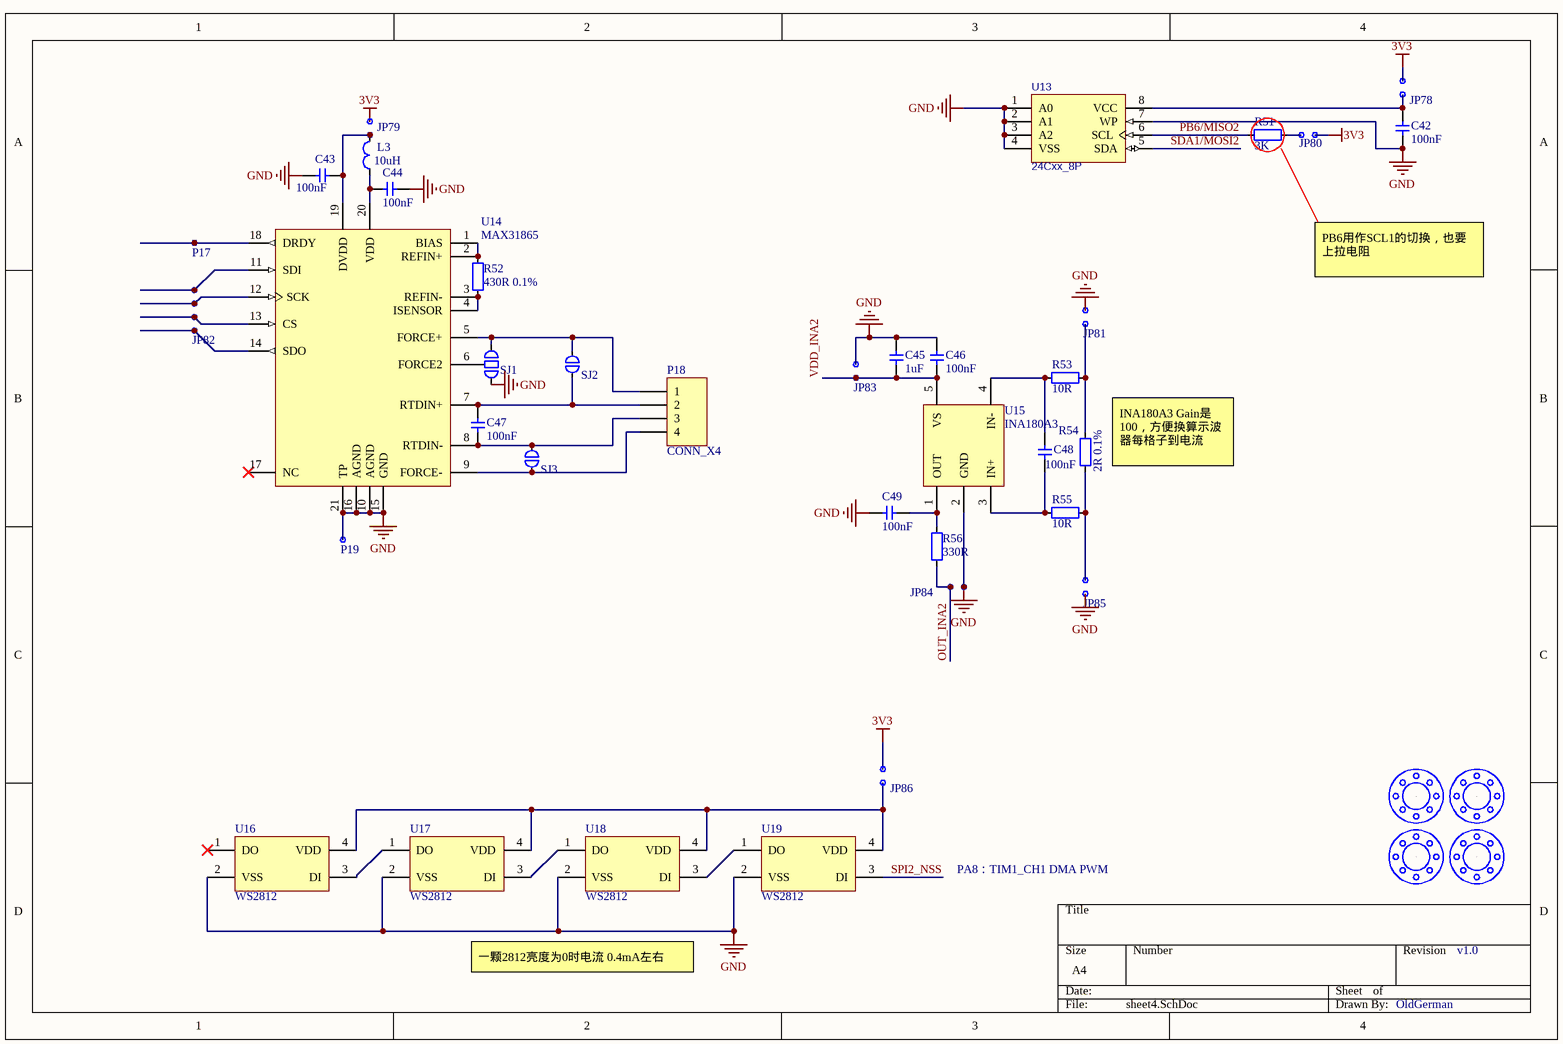
[diagram p3: sheet4.SchDoc]

### Parts
C42  100nF  [C0603]
C43  100nF  [C0603]
C44  100nF  [C0603]
C45  1uF  [C0603]
C46  100nF  [C0603]
C47  100nF  [C0603]
C48  100nF  [C0603]
C49  100nF  [C0603]
JP78  CONN_X2_DOT  [2.54mm_Male_x2]  (value not drawn)
JP79  CONN_X2_DOT  [2.54mm_Male_x2]  (value not drawn)
JP80  CONN_X2_DOT  [2.54mm_Male_x2]  (value not drawn)
JP81  CONN_X2_DOT  [2.54mm_Male_x2]  (value not drawn)
JP82  CONN_X4_DOT  [2.54mm_Male_x4]  (value not drawn)
JP83  CONN_X2_DOT  [2.54mm_Male_x2]  (value not drawn)
JP84  CONN_X2_DOT  [2.54mm_Male_x2]  (value not drawn)
JP85  CONN_X2_DOT  [2.54mm_Male_x2]  (value not drawn)
JP86  CONN_X2_DOT  [2.54mm_Male_x2]  (value not drawn)
L3  10uH  [FER0603]
P17  CONN_X1_DOT  [2.54mm_Male_x1]  (value not drawn)
P18  CONN_X4  [2.54mm_Male_x4]
P19  CONN_X1_DOT  [2.54mm_Male_x1]  (value not drawn)
R51  3K  [R0603]
R52  430R 0.1%  [R0603]
R53  10R  [R0603]
R54  2R 0.1%  [R0805]
R55  10R  [R0603]
R56  330R  [R0603]
SJ1  SJ_3P  [SJ_3P]  (value not drawn)
SJ2  SJ_2P  [SJ_2P]  (value not drawn)
SJ3  SJ_2P  [SJ_2P]  (value not drawn)
SUN_HOLE1  SUN_HOLE  [SUN_HOLE_M3]  (value not drawn)
SUN_HOLE2  SUN_HOLE  [SUN_HOLE_M3]  (value not drawn)
SUN_HOLE3  SUN_HOLE  [SUN_HOLE_M3]  (value not drawn)
SUN_HOLE4  SUN_HOLE  [SUN_HOLE_M3]  (value not drawn)
U13  24Cxx_8P  [ANALOG DEV SOIC-8 R8]
U14  MAX31865  [VQFN-20 5x5MM 0.65]
U15  INA180A3  [TI SOT-23-5 DBV]
U16  WS2812  [WS2812_2020]
U17  WS2812  [WS2812_2020]
U18  WS2812  [WS2812_2020]
U19  WS2812  [WS2812_2020]

### Nets
3V3: JP78.1 JP79.1 JP80.2 JP86.1
GND: C42.2 C43.2 C44.2 C45.2 C46.2 C49.2 JP81.1 JP83.1 JP84.2 JP85.2 P19.1 SJ1.3 U13.1(A0) U13.2(A1) U13.3(A2) U13.4(VSS) U13.7(WP) U14.10(AGND) U14.15(GND) U14.16(AGND) U14.21(TP) U15.2(GND) U16.2(VSS) U17.2(VSS) U18.2(VSS) U19.2(VSS)
OUT_INA2: JP84.1 R56.1
PB6/MISO2: R51.1 U13.6(SCL)
SDA1/MOSI2: U13.5(SDA)
SPI2_NSS: U19.3(DI)
VDD_INA2: C45.1 C46.1 JP83.2 U15.5(VS)
NetC42_1: C42.1 JP78.2 U13.8(VCC)
NetC43_1: C43.1 JP79.2 L3.2 U14.19(DVDD)
NetC44_1: C44.1 L3.1 U14.20(VDD)
NetC47_1: C47.1 P18.2 SJ2.2 U14.7(RTDIN+)
NetC47_2: C47.2 P18.3 SJ3.1 U14.8(RTDIN-)
NetC48_1: C48.1 R55.1 U15.3(IN+)
NetC48_2: C48.2 R53.1 U15.4(IN-)
NetC49_1: C49.1 R56.2 U15.1(OUT)
NetJP80_1: JP80.1 R51.2
NetJP81_2: JP81.2 R53.2 R54.1
NetJP82_1: JP82.1 U14.11(SDI)
NetJP82_2: JP82.2 U14.12(SCK)
NetJP82_3: JP82.3 U14.13(CS)
NetJP82_4: JP82.4 U14.14(SDO)
NetJP85_1: JP85.1 R54.2 R55.2
NetJP86_2: JP86.2 U16.4(VDD) U17.4(VDD) U18.4(VDD) U19.4(VDD)
NetP17_1: P17.1 U14.18(DRDY)
NetP18_1: P18.1 SJ1.1 SJ2.1 U14.5(FORCE+)
NetP18_4: P18.4 SJ3.2 U14.9(FORCE-)
NetR52_1: R52.1 U14.3(REFIN-) U14.4(ISENSOR)
NetR52_2: R52.2 U14.1(BIAS) U14.2(REFIN+)
NetSJ1_2: SJ1.2 U14.6(FORCE2)
NetU16_3: U16.3(DI) U17.1(DO)
NetU17_3: U17.3(DI) U18.1(DO)
NetU18_3: U18.3(DI) U19.1(DO)

Not connected (* = marked no-connect by the designer): SUN_HOLE1 1; SUN_HOLE2 1; SUN_HOLE3 1; SUN_HOLE4 1; U14 17(NC)*; U16 1(DO)*

### Notes on the sheet
- PB6用作SCL1的切换，也要上拉电阻
- INA180A3 Gain是100，方便换算示波器每格子到电流
- PA8：TIM1_CH1 DMA PWM
- 一颗2812亮度为0时电流 0.4mA左右
- v1.0
- OldGerman

### Library data of the parts
C42-C49 = CAP: Capacitor; Value: 0.1u
L3 = inductor_mini: 贴片叠层电感
R51-R56 = RES: Resistor; Value: 22R
SJ1 = SJ_3P: 焊接跳线二选一
SJ2 SJ3 = SJ_2P: 焊接跳线
U15 = INA180Ax: as U3 on sheet sheet1

## Nets that join several sheets
3V3: sheet1 (13 pins), sheet2 (5 pins), sheet3 (13 pins), sheet4 (JP78.1 JP79.1 JP80.2 JP86.1)
GND: sheet1 (73 pins), sheet2 (11 pins), sheet3 (40 pins), sheet4 (26 pins)
BAT_INFO: sheet1 (C6.1 R2.1 R9.2), sheet2 (JP32.3)
Charge_Detect: sheet1 (R5.1 U2.1), sheet2 (JP23.3)
DISP_CS: sheet2 (JP41.3), sheet3 (LCD1.8)
DISP_DC: sheet2 (JP43.3), sheet3 (LCD1.10)
DISP_RES: sheet2 (JP28.3), sheet3 (LCD1.9)
GPIO_ndef: sheet2 (JP45.3), sheet3 (JP73.2 Q6.3 R48.2 U12.4)
I2C1_SCL/SPI2_SCK: sheet2 (JP50.3), sheet3 (R43.2 RN3.2)
I2C1_SDA/SPI2_MOSI: sheet2 (JP48.3), sheet3 (R42.2 RN3.3)
I2C2_SCL: sheet2 (JP37.3), sheet3 (R41.2 U8.4)
I2C2_SDA: sheet2 (JP39.3), sheet3 (R40.2 U8.6)
INT: sheet1 (JP14.1), sheet2 (JP36.3), sheet3 (JP53.2)
KEY1: sheet2 (JP25.3), sheet3 (C41.2 SW6.3 SW6.4)
KEY2: sheet1 (VD2.3), sheet3 (C39.2 SW5.3 SW5.4)
KEY3: sheet2 (JP27.3), sheet3 (C36.2 SW4.3 SW4.4)
KEY_OK: sheet1 (VD2.2), sheet2 (JP34.3)
PA2/TX: sheet1 (R29.2 R37.2), sheet2 (JP33.1)
PA3/RX: sheet1 (R28.2 R36.2), sheet2 (JP31.1)
PB6/MISO2: sheet3 (RN3.5 U7.1), sheet4 (R51.1 U13.6)
PW_HOLD: sheet1 (R16.1), sheet2 (JP29.3)
SDA1/MOSI2: sheet3 (5 pins), sheet4 (U13.5)
SPI1_MOSI: sheet2 (JP30.3), sheet3 (LCD1.12)
SPI1_SCK: sheet2 (JP42.3), sheet3 (LCD1.11)
SPI2_MISO: sheet2 (JP47.3), sheet3 (RN3.4)
SPI2_NSS: sheet2 (JP35.3), sheet4 (U19.3)
VbatWeek: sheet1 (VD1.2), sheet2 (JP44.1), sheet3 (7 pins)